# EAGLE design CURTOVOLT (EAGLE 6.0)
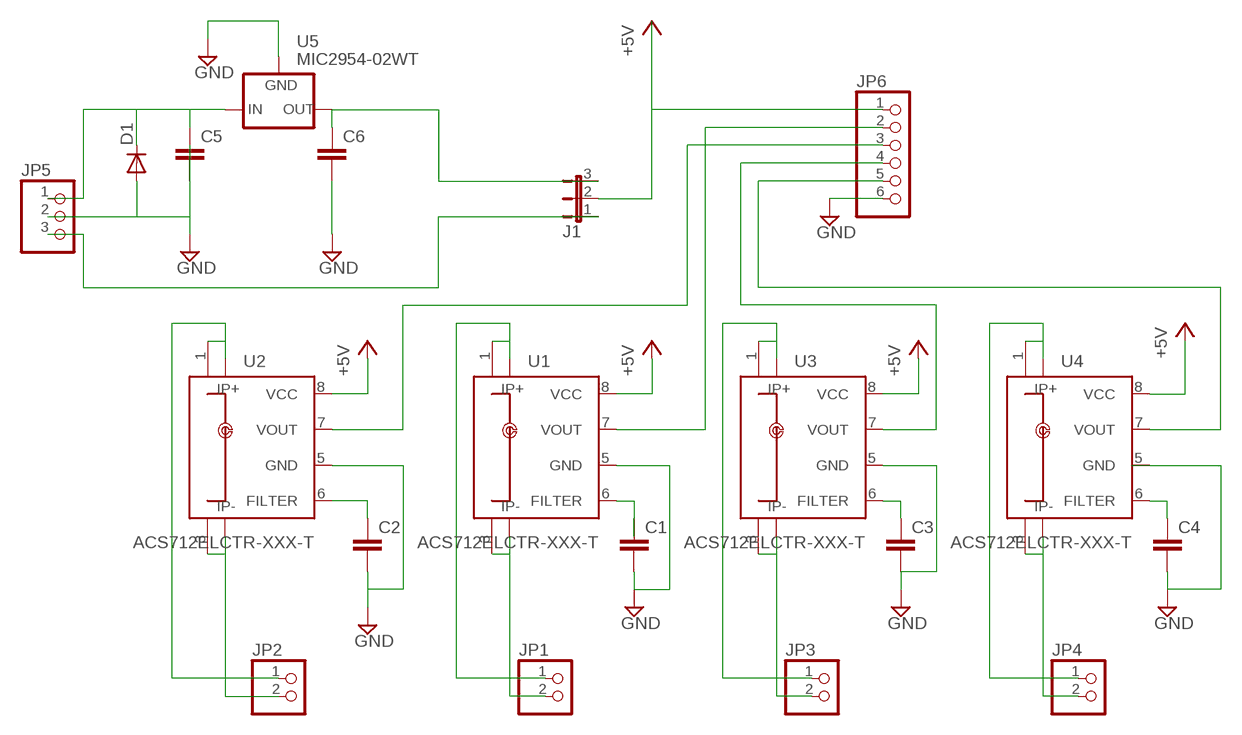
[diagram p0: schematic, sheet 1]

## Parts
C1  C-EUC1206  [C1206]
C2  C-EUC1206  [C1206]
C3  C-EUC1206  [C1206]
C4  C-EUC1206  [C1206]
C5  C-EUC1206  [C1206]
C6  C-EUC1206  [C1206]
D1  DIODE-DO-214AC  [DO-214AC]
J1  JP2E  [JP2]
JP1  PINHD-1X2/5MM  [1X02/5MM]
JP2  PINHD-1X2/5MM  [1X02/5MM]
JP3  PINHD-1X2/5MM  [1X02/5MM]
JP4  PINHD-1X2/5MM  [1X02/5MM]
JP5  PINHD-1X3/3.5MM  [1X03/3.5MM]
JP6  PINHD-1X6/3.5MM  [1X06/3.5MM]
U1  ACS712ELCTR-XXX-T  [SO8]
U2  ACS712ELCTR-XXX-T  [SO8]
U3  ACS712ELCTR-XXX-T  [SO8]
U4  ACS712ELCTR-XXX-T  [SO8]
U5  MIC2954-02WT  [TO220V]

## Nets
+5V: J1.2 JP6.1 U1.8(VCC) U2.8(VCC) U3.8(VCC) U4.8(VCC)
GND: C1.2 C2.2 C3.2 C4.2 C5.2 C6.2 D1.A JP5.2 JP6.6 U1.5(GND) U2.5(GND) U3.5(GND) U5.2(GND)
N$1: C2.1 U2.6(FILTER)
N$3: C1.1 U1.6(FILTER)
N$4: C3.1 U3.6(FILTER)
N$5: C4.1 U4.6(FILTER)
N$7: C5.1 D1.C JP5.1 U5.1(IN)
N$8: J1.1 JP5.3
N$9: C6.1 J1.3 U5.3(OUT)
N$11: JP6.3 U2.7(VOUT)
N$12: JP6.2 U1.7(VOUT)
N$13: JP6.4 U3.7(VOUT)
N$14: JP6.5 U4.7(VOUT)
N$15: JP2.2 U2.3(IP-) U2.4(IP-1)
N$18: JP2.1 U2.1(IP+) U2.2(IP+1)
N$20: JP1.1 U1.1(IP+) U1.2(IP+1)
N$21: JP1.2 U1.3(IP-) U1.4(IP-1)
N$22: JP3.1 U3.1(IP+) U3.2(IP+1)
N$23: JP3.2 U3.3(IP-) U3.4(IP-1)
N$24: JP4.1 U4.1(IP+) U4.2(IP+1)
N$25: JP4.2 U4.3(IP-) U4.4(IP-1)

## Power pins joined to a net without a drawn wire
GND: U4.5(GND)

## Library data of the parts
C1-C6 = rcl:C-EU: CAPACITOR, European symbol
D1 = diode:DIODE-: DIODE
J1 = jumper:JP2E: JUMPER
JP1-JP4 = pinhead:PINHD-1X2: PIN HEADER
JP5 = pinhead:PINHD-1X3: PIN HEADER
JP6 = pinhead:PINHD-1X6: PIN HEADER
U1-U4 = allegro:ACS712: Hall Effect-Based Linear Current Sensor
U5 = v-reg-micrel:MIC2954

## Board
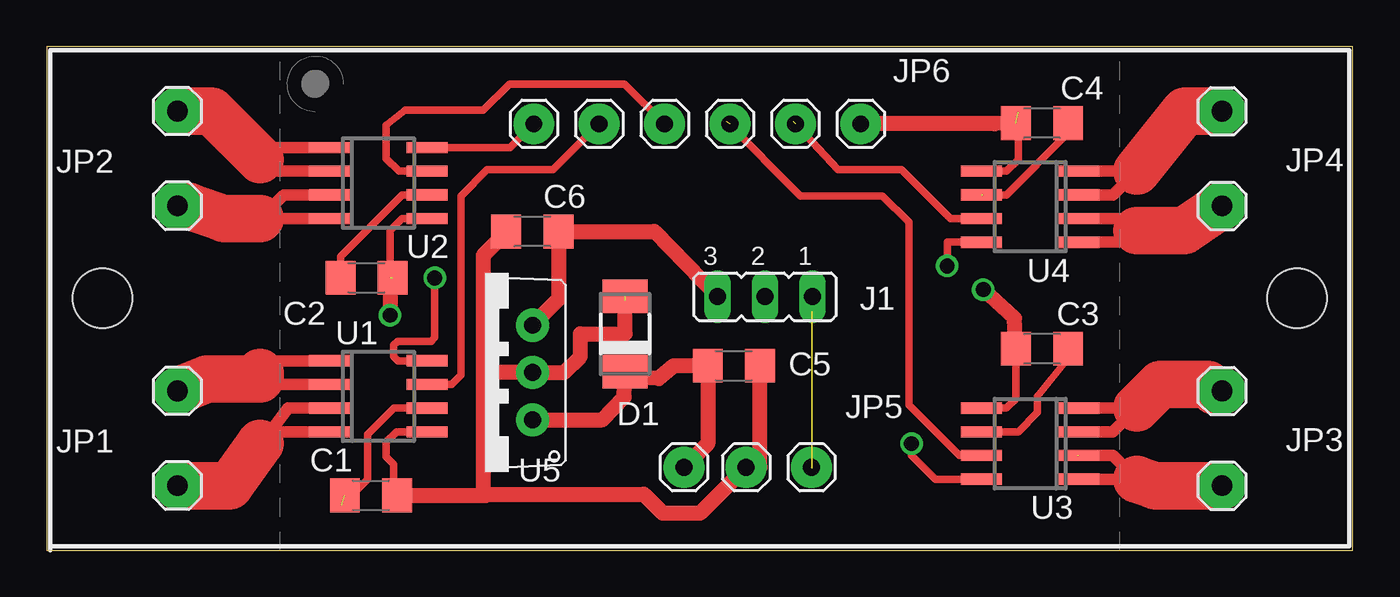
[diagram p1: board, top side]
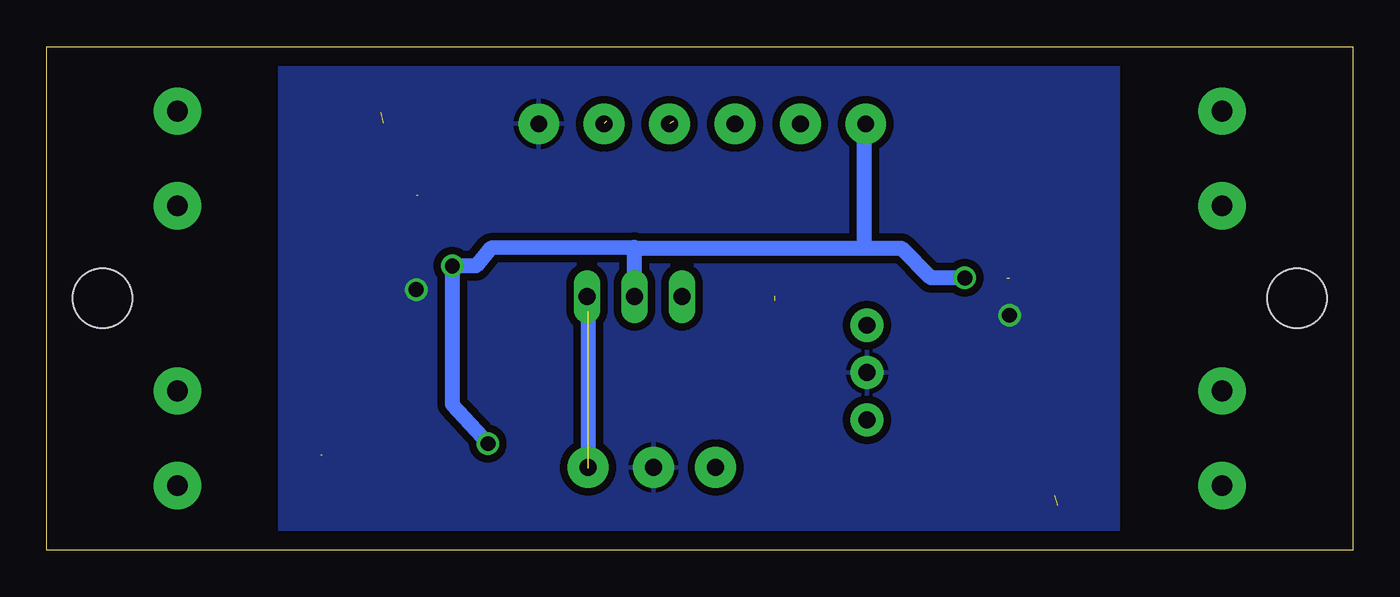
[diagram p2: board, bottom side, seen from below]

Size 70 x 27 mm. Coordinates in mm from the lower left corner, seen from the top.
Outline: 0,0 70,0 70,27 0,27 0,0
Copper layers (1*16): Top 0.035mm / dielectric 1.5mm / Bottom 0.035mm
Design rules: minimum track width 10mil, minimum drill 24mil, track to track 0.4mm, track to pad 0.4mm, pad to pad 8mil, via to via 8mil, smd to smd 8mil, copper to edge 40mil, drill to drill 8mil, minimum pad ring 10mil, minimum via ring 8mil, stop-mask expansion 4mil, vias tented up to drill 0mil, thermal gap 10mil
Holes 3.2 mm at 3,13.5 67,13.5

### Footprints (pad centres in the part's own frame; a part is rotated, then mirrored left to right if it is on the bottom)
C1206 = smd 1.6 x 1.8: 1 -1.4,0; 2 1.4,0
DO-214AC = smd 1.8 x 2.4: A 2.025,0; C -2.025,0
JP2 = drill 0.914 long: 1 -2.54,0; 2 0,0; 3 2.54,0
1X02/5MM = drill 1.1 pad 2.54: 1 -2.54,0; 2 2.54,0
1X03/3.5MM = drill 0.9 pad 2.184: 1 -5.08,0; 2 -1.75,0; 3 1.755,0
1X06/3.5MM = drill 0.9 pad 2.184: 1 -8.82,0; 2 -5.315,0; 3 -1.81,0; 4 1.695,0; 5 5.2,0; 6 8.705,0
SO8 = smd 0.6 x 2.2: 1 -1.905,-2.6; 2 -0.635,-2.6; 3 0.635,-2.6; 4 1.905,-2.6; 5 1.905,2.6; 6 0.635,2.6; 7 -0.635,2.6; 8 -1.905,2.6
TO220V = drill 0.9 pad 1.778: 1 -2.54,0; 2 0,0; 3 2.54,0

### Placement (x,y rotation side)
C1  17.38,2.94 0 top
C2  17.14,14.61 0 top
C3  53.34,10.79 180 top
C4  53.34,22.89 180 top
C5  36.83,9.89 0 top
C6  26.03,17.09 180 top
D1  31,11.6 90 top
J1  38.5,13.6 180 top
JP1  7,6 270 top
JP2  7,21 270 top
JP3  63,6 90 top
JP4  63,21 90 top
JP5  39.23,4.45 0 top
JP6  34.92,22.86 0 top
U1  17.78,8.26 270 top
U2  17.78,19.68 270 top
U3  52.7,5.71 90 top
U4  52.7,18.41 90 top
U5  26.04,9.53 90 top
U$1  [ISTERRE-3]  14.4,25 0 top

### Tracks (layer width: path | path; a pad name or v marks a point on that pad's centre or on a via)
+5V  (via drill 0.8)
  Top 0.406: v48.26,15.24 48.26,16.51 U4.8 | v46.35,5.71 46.35,5.08 47.62,3.81 U3.8 | U2.8 24.84,21.59 JP6.1 | U1.8 18.84,10.16 18.6,10.4 18.6,11 18.8,11.2 20.6,11.2 20.8,11.4 v20.8,14.6
  Bottom 0.813: J1.2 38.5,16.2 | 38.5,16.2 38.5,16.24 46.2,16.2 47,15.24 v48.26,15.24 48.26,7.82 v46.35,5.71 | v20.8,14.6 22.6,14.6 24.2,16.2 26.2,16.2 | 38.5,16.2 26.2,16.2 | JP6.1 26.2,22.86 26.2,16.2
GND  (via drill 0.8)  (3 unrouted)
  Top 0.406: C3.2 51.94,8.12 51.44,7.62 U3.5 | U4.5 51.44,20.32 52.07,20.95 52.07,23.5 | U2.5 19.05,17.78 18.41,17.14 18.41,14.61 | U1.5 18.75,6.35 18.2,5.8 18.2,5 18.6,4.6 18.6,2.72 C1.2
  Top 0.813: C4.2 50.8,22.86 JP6.6 | C3.2 51.87,12.44 v50.2,13.97 | C5.2 38.23,4.45 JP5.2 35.03,2 33,2 32,3 23.4,3 | C6.2 24.63,17.03 23.4,15.8 23.4,9.4 | 23.4,9.4 23.4,3 | C1.2 23.54,2.94 23.4,3 | 31,13.4 31,11.6 28.6,11.6 28.6,10.4 27.73,9.53 U5.2 23.52,9.53 23.4,9.4 | 18.41,14.61 18.41,12.62 v18.4,12.6
  pour Bottom: 57.5,0.3 12.6,0.3 12.6,26.8 57.5,26.8
N$1
  Top 0.406: C2.1 15.74,15.74 19.05,19.05 U2.6
N$3  (1 unrouted)
  Top 0.406: U1.6 18.62,7.62 17.2,6.2 17.2,3.8 15.8,2.4
N$4
  Top 0.406: C3.1 54.74,10.29 53.1,8.26 53.1,7.38 52.07,6.35 U3.6
N$5  (1 unrouted)
  Top 0.406: C4.1 54.74,22.36 51.44,19.05 50.16,19.05
N$7
  Top 0.813: U5.1 26.39,6.99 29.8,7 30.95,8.2 D1.C 31.24,9.29 32.8,9.2 33.6,9.89 C5.1 35.43,5.72 JP5.1
N$8  (3 unrouted)
  Bottom 0.813: J1.1 41,13.6 41,4.4
N$9
  Top 0.813: J1.3 32.58,17.09 C6.1 27.43,13.46 U5.3
N$11
  Top 0.406: U2.7 18.88,20.32 18.2,21 18.2,22.8 19.2,23.6 23.2,23.6 23.4,23.6 24.8,25 30.98,25 JP6.3
N$12
  Top 0.406: U1.7 21.69,8.89 22.2,9.4 22.2,19 23.6,20.4 27.15,20.4 JP6.2
N$13  (1 unrouted)
  Top 0.406: U3.7 48.92,5.08 46.2,7.8 46.2,17.6 44.8,19 40.4,19 36.4,23
N$14  (1 unrouted)
  Top 0.406: U4.7 48.42,17.78 45.8,20.4 42.4,20.4 40,23
N$15
  Top 0.61: U2.4 12.06,17.78 10.4,17.78 | U2.3 12.7,19.05 11.43,17.78
  Top 2.54: JP2.2 7.58,18.46 9.53,17.78 10.4,17.78 11.43,17.78
N$18
  Top 0.61: U2.2 11.43,20.32 11.43,21.59 | U2.1 11.43,21.59 | 11.43,21.59 11.09,21.59 11.09,21.29
  Top 2.54: JP2.1 8.85,23.54 11.09,21.29 11.43,20.95
N$20
  Top 0.61: U1.2 12.06,8.89 11.43,8.89 11.43,9.18 | U1.1 12.06,10.16 11.43,10.16 11.43,9.53
  Top 2.54: JP1.1 8.61,9.18 11.43,9.18 11.43,9.53
N$21
  Top 0.61: U1.3 12.94,7.62 11.76,6.04 | 11.76,6.04 11.43,5.71 | U1.4 11.76,6.35 | 11.43,6.35 11.76,6.35 | 11.76,6.35 11.76,6.04
  Top 2.54: JP1.2 9.81,3.46 11.43,5.71
N$22  (1 unrouted)
  Top 0.61: U3.1 57.78,3.81 58.42,3.81 57.15,5.08 55.24,5.08
  Top 2.54: JP3.1 59.41,3.46 58.42,3.81
N$23
  Top 0.61: U3.4 58.42,7.62 57.15,6.35 U3.3
  Top 2.54: JP3.2 62.58,8.54 62.23,8.89 59.69,8.89 58.42,7.62
N$24
  Top 0.61: U4.1 58.42,16.51 58.4,16.51 58.4,16.4 | U4.2 58.42,17.78 58.4,17.78 58.4,16.4 | 58.42,17.14 58.4,17.14 58.4,16.4
  Top 2.54: JP4.1 62.91,18.46 60.96,17.14 58.42,17.14
N$25
  Top 0.61: U4.3 57.15,19.05 58.42,20.32 U4.4
  Top 2.54: JP4.2 61.01,23.54 58.42,20.32

### Text on the board
tDocu: 5V | O1 | O2 | O3 | O4 | GND | + | - | + | - | + | - | - | + | + | VCC | 5V | + | + | + | - | - | - | + | - | + | CURTOVOLT REV A0 - 26/01/2012 | VCC | GND | 5V